# Altium schematic sheet karmanDB_power.SchDoc
size A
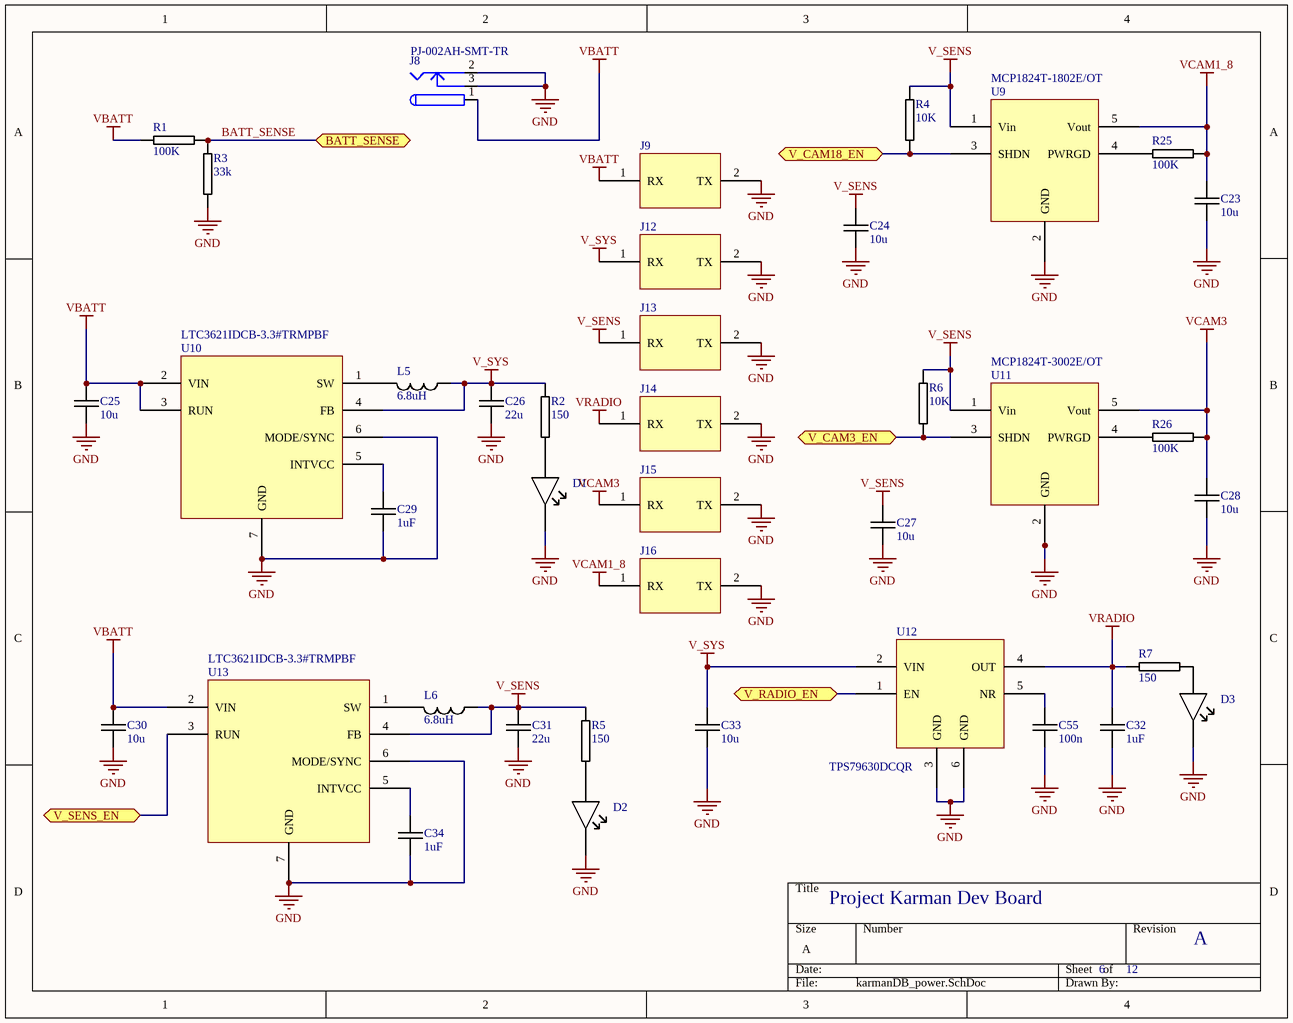
[diagram p0: karmanDB_power.SchDoc]

## Parts
C23  10u  [MURATA_GRM_0603]
C24  10u  [MURATA_GRM_0603]
C25  10u  [MURATA_GRM_0603]
C26  22u  [MURATA_GRM_0603]
C27  10u  [MURATA_GRM_0603]
C28  10u  [MURATA_GRM_0603]
C29  1uF  [MURATA_GRM_0402]
C30  10u  [MURATA_GRM_0603]
C31  22u  [MURATA_GRM_0603]
C32  1uF  [MURATA_GRM_0402]
C33  10u  [MURATA_GRM_0603]
C34  1uF  [MURATA_GRM_0402]
C55  100n  [MURATA_GRM_0603]
D1  LED_LITEON_LTST-C150CKT  [LITEON_LTST-C150]  (value not drawn)
D2  LED_LITEON_LTST-C150CKT  [LITEON_LTST-C150]  (value not drawn)
D3  LED_LITEON_LTST-C150CKT  [LITEON_LTST-C150]  (value not drawn)
J8  PJ-002AH-SMT-TR  [PJ-002AH-SMT]
J9  961102-6404-AR  [3M_961102-6X04]  (value not drawn)
J12  961102-6404-AR  [3M_961102-6X04]  (value not drawn)
J13  961102-6404-AR  [3M_961102-6X04]  (value not drawn)
J14  961102-6404-AR  [3M_961102-6X04]  (value not drawn)
J15  961102-6404-AR  [3M_961102-6X04]  (value not drawn)
J16  961102-6404-AR  [3M_961102-6X04]  (value not drawn)
L5  6.8uH  [TDK_RLF7030]
L6  6.8uH  [TDK_RLF7030]
R1  100K  [PANASONIC_ERJ3R]
R2  150  [PANASONIC_ERJ3R]
R3  33k  [PANASONIC_ERJ2R_SERIES]
R4  10K  [PANASONIC_ERJ3R]
R5  150  [PANASONIC_ERJ3R]
R6  10K  [PANASONIC_ERJ3R]
R7  150  [PANASONIC_ERJ3R]
R25  100K  [PANASONIC_ERJ3R]
R26  100K  [PANASONIC_ERJ3R]
U9  MCP1824T-1802E/OT  [26-27 MCP1824T(-3002E/OT)(-1802E/OT)]
U10  LTC3621IDCB-3.3#TRMPBF  [29 LTC3621IDCB-3.3]
U11  MCP1824T-3002E/OT  [26-27 MCP1824T(-3002E/OT)(-1802E/OT)]
U12  TPS79630DCQR  [TPS79630]
U13  LTC3621IDCB-3.3#TRMPBF  [29 LTC3621IDCB-3.3]

## Ports
BATT_SENSE (bidir), V_CAM3_EN (bidir), V_CAM18_EN (bidir), V_RADIO_EN (bidir), V_SENS_EN (bidir)

## Nets
GND: C23.2 C24.2 C25.2 C26.2 C27.2 C28.2 C29.2 C30.2 C31.2 C32.2 C33.2 C34.2 C55.2 D1.K D2.K D3.K J8.2 J8.3 J9.2(TX) J12.2(TX) J13.2(TX) J14.2(TX) J15.2(TX) J16.2(TX) R3.2 U9.2(GND) U10.6(MODE/SYNC) U10.7(GND) U11.2(GND) U12.3(GND) U12.6(GND) U13.6(MODE/SYNC) U13.7(GND)
V_SENS: C24.1 C27.1 C31.1 J13.1(RX) L6.1 R4.1 R5.1 R6.1 U9.1(Vin) U11.1(Vin) U13.4(FB)
V_SYS: C26.1 C33.1 J12.1(RX) L5.1 R2.2 U10.4(FB) U12.2(VIN)
VBATT: C25.1 C30.1 J8.1 J9.1(RX) R1.1 U10.2(VIN) U10.3(RUN) U13.2(VIN)
VCAM1_8: C23.1 J16.1(RX) R25.2 U9.5(Vout)
VCAM3: C28.1 J15.1(RX) R26.2 U11.5(Vout)
VRADIO: C32.1 J14.1(RX) R7.1 U12.4(OUT)
BATT_SENSE: R1.2 R3.1 ; port BATT_SENSE
V_CAM3_EN: R6.2 U11.3(SHDN) ; port V_CAM3_EN
V_CAM18_EN: R4.2 U9.3(SHDN) ; port V_CAM18_EN
V_RADIO_EN: U12.1(EN) ; port V_RADIO_EN
V_SENS_EN: U13.3(RUN) ; port V_SENS_EN
NetC29_1: C29.1 U10.5(INTVCC)
NetC34_1: C34.1 U13.5(INTVCC)
NetC55_1: C55.1 U12.5(NR)
NetD1_A: D1.A R2.1
NetD2_A: D2.A R5.2
NetD3_A: D3.A R7.2
NetL5_2: L5.2 U10.1(SW)
NetL6_2: L6.2 U13.1(SW)
NetR25_1: R25.1 U9.4(PWRGD)
NetR26_1: R26.1 U11.4(PWRGD)

## Notes on the sheet
- Project Karman Dev Board
- 6
- 12
- A

## Library data of the parts
C23-C25 C27 C28 C30 C33 = CAP_MURATA_GRM188R60J106: CAP CER 10UF 6.3V 20% X5R 0603; Manufacturer: Murata Electronics North America; Manufacturer Part Number: GRM188R60J106ME47J; Capacitance: 10µF; Supplier 1: Digi-Key; Supplier Part Number 1: 490-6405-1-ND; RoHS: RoHS Compliant; Category: Capacitors; Stock 1: 159118; Pricing: 1=0.19, 10=0.128, 50=0.0776, 100=0.0651, 250=0.05272, 500=0.0465, 1000=0.03953, 5000=0.03333 (USD); Packaging: Cut Tape (CT); Tolerance: ±20%; Voltage - Rated: 6.3V; Temperature Coefficient: X5R; Mounting Type: Surface Mount, MLCC; Operating Temperature: -55°C ~ 85°C; Applications: General Purpose; Ratings: -; Package / Case: 0603 (1608 Metric); Size / Dimension: 0.063" L x 0.031" W (1.60mm x 0.80mm); Height - Seated (Max): -; Thickness (Max): 0.035" (0.90mm); Lead Spacing: -; Features: -; Lead Style: -; ComponentLink1URL: http://www.murata.com/~/media/webrenewal/support/library/catalog/products/capacitor/mlcc/c02e.ashx; ComponentLink1Description: http://www.murata.com/~/media/webrenewal/support/library/catalog/products/capacitor/mlcc/c02e.ashx
C26 C31 = CAP_MURATA_GRM188R61A226ME15D: CAP CER 22UF 10V 20% X5R 0603; Manufacturer: Murata Electronics North America; Capacitance: 22µF; Supplier 1: Digi-Key; Supplier Part Number 1: 490-10476-1-ND; Manufacturer Part Number: GRM188R61A226ME15D; RoHS: RoHS Compliant; Category: Capacitors; Stock 1: 2895; Pricing: 1=0.3, 10=0.249, 25=0.1712, 50=0.14, 100=0.1244, 250=0.09332, 500=0.08242, 1000=0.07309 (USD); Packaging: Cut Tape (CT); Tolerance: ±20%; Voltage - Rated: 10V; Temperature Coefficient: X5R; Mounting Type: Surface Mount, MLCC; Operating Temperature: -55°C ~ 85°C; Applications: General Purpose; Ratings: -; Package / Case: 0603 (1608 Metric); Size / Dimension: 0.063" L x 0.031" W (1.60mm x 0.80mm); Height - Seated (Max): -; Thickness (Max): 0.039" (1.00mm); Lead Spacing: -; Features: -; Lead Style: -; ComponentLink1URL: http://www.murata.com/~/media/webrenewal/support/library/catalog/products/capacitor/mlcc/c02e.ashx; ComponentLink1Description: http://www.murata.com/~/media/webrenewal/support/library/catalog/products/capacitor/mlcc/c02e.ashx
C29 C32 C34 = CAP_MURATA_GRM155R61A105KE15D: CAP CER 1uF 10volts X5R 10% 0402; Manufacturer: Murata Electronics; Type: General Purpose MLCC; Voltage Rating DC: 10 V; Supplier 1: Mouser; Manufacturer Part Number: GRM155R61A105KE15D; RoHS: RoHS Compliant; Category: Multilayer Ceramic Capacitors MLCC - SMD/SMT; Stock 1: 726006; Pricing 1: 1=0.528, 10=0.066, 100=0.038, 1000=0.030, 2500=0.026, 10000=0.021, 20000=0.019, 50000=0.016, 100000=0.014 (AUD); Capacitance: 1 uF; Height: 0.5 mm; Length: 1 mm; Package / Case: 0402 (1005 metric); Packaging: Reel; Product: General Type MLCCs; Series: GRM; Termination Style: SMD/SMT; Tolerance: 10 %; Width: 0.5 mm; Brand: Murata Electronics; Case Code - in: 0402; Case Code - mm: 1005; Dielectric: X5R; Maximum Operating Temperature: + 85 C; Minimum Operating Temperature: - 55 C; Product Category: High Capacitance SMD Ceramic Chip Capacitors; Standard Pack Qty: 10000; RoHS - Mouser: Y; Minimum Order Quantity: 1; Reeling: True; ComponentLink1URL: http://www.mouser.com/ds/2/281/c02e-2905.pdf; ComponentLink1Description: http://www.mouser.com/ds/2/281/c02e-2905.pdf; Supplier Part Number 1: 81-GRM155R61A105KE15
C55 = CAP_MURATA_GRM188R70J104KA01D: CAP CER 0.1UF 6.3V 10% X7R 0603; Manufacturer: Murata Electronics North America; Capacitance: 0.1µF; Supplier 1: Digi-Key; Supplier Part Number 1: 490-9730-1-ND; Manufacturer Part Number: GRM188R70J104KA01D; RoHS: RoHS Compliant; Category: Capacitors; Stock 1: 25826; Pricing: 1=0.1, 10=0.061, 50=0.0332, 100=0.0281, 250=0.02296, 500=0.01964, 1000=0.0153 (USD); Packaging: Cut Tape (CT); Tolerance: ±10%; Voltage - Rated: 6.3V; Temperature Coefficient: X7R; Mounting Type: Surface Mount, MLCC; Operating Temperature: -55°C ~ 125°C; Applications: General Purpose; Ratings: -; Package / Case: 0603 (1608 Metric); Size / Dimension: 0.063" L x 0.031" W (1.60mm x 0.80mm); Height - Seated (Max): -; Thickness (Max): 0.035" (0.90mm); Lead Spacing: -; Features: -; Lead Style: -; ComponentLink1URL: http://www.murata.com/~/media/webrenewal/support/library/catalog/products/capacitor/mlcc/c02e.ashx; ComponentLink1Description: http://www.murata.com/~/media/webrenewal/support/library/catalog/products/capacitor/mlcc/c02e.ashx
D1-D3 = LED_LITEON_LTST-C150CKT: LED RED CLEAR 1206 SMD; Manufacturer: Lite-On Inc; Wavelength - Dominant: 638nm; Wavelength - Peak: 660nm; Millicandela Rating: 10mcd; Voltage - Forward (Vf) (Typ): 1.8V; Current - Test: 10mA; Viewing Angle: 130°; Lens Color: Colorless; Lens Style/Size: Rectangle with Flat Top, 2.06mm x 1.60mm; Supplier 1: Digi-Key; Supplier Part Number 1: 160-1167-1-ND; Manufacturer Part Number: LTST-C150CKT; RoHS: RoHS Compliant; Category: Optoelectronics; Stock 1: 90600; Pricing: 1=0.4, 10=0.297, 100=0.1574, 250=0.11136, 500=0.09504, 1000=0.07425 (USD); Packaging: Cut Tape (CT); Color: Red; Lens Transparency: Clear; Package / Case: 1206 (3216 Metric); Supplier Device Package: 1206; Size / Dimension: 3.20mm L x 1.60mm W; Height (Max): 1.10mm; Mounting Type: Surface Mount; ComponentLink1URL: http://optoelectronics.liteon.com/upload/download/DS-22-98-0002/S_110_LTST-C150CKT.pdf; ComponentLink1Description: http://optoelectronics.liteon.com/upload/download/DS-22-98-0002/S_110_LTST-C150CKT.pdf
J8 = PJ-002AH-SMT-TR: CONN POWER JACK 2.1X5.5MM HI CUR; Manufacturer: CUI Inc.; Gender: Male; Plug/Mating Plug Diameter: 2.1mm ID, 5.5mm OD; Number of Positions/Contacts: 2 Conductors, 3 Contacts; Internal Switch(s): Single Switch, Normally Closed; Shielding: Unshielded; Voltage - Rated: 24VDC; Current Rating: 5A; Supplier 1: Digi-Key; Manufacturer Part Number: PJ-002AH-SMT-TR; RoHS: RoHS Compliant; Category: Connectors, Interconnects; Stock 1: 15720; Pricing 1: 1=1.89, 10=1.469, 100=1.121 (USD); Connector Type: Jack; Mounting Type: Surface Mount; Termination: Solder; Features: -; Color: Black; Contact Material: Copper Alloy; Contact Material - Plating: Nickel; Housing Color: Black; Housing Material: Thermoplastic; Operating Temperature: -25°C ~ 85°C; ComponentLink1URL: http://www.cui.com/product/resource/digikeypdf/pj-002ah-smt.pdf; ComponentLink1Description: http://www.cui.com/product/resource/digikeypdf/pj-002ah-smt.pdf; Supplier Part Number 1: CP-002AHPJCT-ND
J9 J12-J16 = 961102-6404-AR: CONN HEADER VERT SGL 2POS GOLD; Manufacturer: 3M; Connector Type: Header, Unshrouded; Number of Positions: 2; Number of Positions Loaded: All; Pitch: 0.100" (2.54mm); Supplier 1: Digi-Key; Manufacturer Part Number: 961102-6404-AR; RoHS: RoHS Compliant; Category: Connectors, Interconnects; Stock 1: 60000; Pricing 1: 1=0.16, 10=0.15, 25=0.128, 50=0.112, 100=0.104, 250=0.092, 500=0.088, 1000=0.072, 2500=0.066 (USD); Packaging: Bulk; Contact Type: Male Pin; Number of Rows: 1; Row Spacing: -; Contact Mating Length: 0.217" (5.50mm); Mounting Type: Through Hole; Termination: Solder; Fastening Type: -; Features: -; Contact Finish: Gold; Contact Finish Thickness: Flash; Color: Black; ComponentLink1URL: http://multimedia.3m.com/mws/mediawebserver?66666UuZjcFSLXTtNxTElX&VEVuQEcuZgVs6EVs6E666666--; ComponentLink1Description: http://multimedia.3m.com/mws/mediawebserver?66666UuZjcFSLXTtNxTElX&VEVuQEcuZgVs6EVs6E666666--; Supplier Part Number 1: 3M9447-ND
L5 L6 = TDK_IND_RLF7030T-6R8M2R8: FIXED IND 6.8UH 2.8A 37.3 MOHM; Manufacturer: TDK Corporation; Type: Wirewound; Material - Core: Ferrite; Inductance: 6.8µH; Tolerance: ±20%; Current - Saturation: 3A; Shielding: Shielded; DC Resistance (DCR): 44.76 mOhm Max; Frequency - Test: 100kHz; Supplier 1: Digi-Key; Manufacturer Part Number: RLF7030T-6R8M2R8; RoHS: RoHS Compliant; Category: Inductors, Coils, Chokes; Stock 1: 8675; Pricing 1: 1=2.31, 10=2.153, 50=1.7528, 100=1.599, 500=1.353 (USD); Packaging: Cut Tape (CT); Current Rating: 2.8A; Q @ Freq: -; Frequency - Self Resonant: -; Operating Temperature: -40°C ~ 125°C; Mounting Type: Surface Mount; Package / Case: Nonstandard; Size / Dimension: 0.287" L x 0.268" W (7.30mm x 6.80mm); Height - Seated (Max): 0.126" (3.20mm); Supplier Device Package: -; ComponentLink1URL: http://product.tdk.com/inductor/ind/en/documents/inductor_commercial_power_rlf_en.pdf; ComponentLink1Description: http://product.tdk.com/inductor/ind/en/documents/inductor_commercial_power_rlf_en.pdf; Supplier Part Number 1: 445-2965-1-ND
R1 R25 R26 = RES_PANASONIC_ERJ-3GEYJ104V: RES SMD 100K OHM 5% 1/10W 0603; Manufacturer: Panasonic Electronic Components; Power (Watts): 0.1W, 1/10W; Temperature Coefficient: ±200ppm/°C; Supplier 1: Digi-Key; Supplier Part Number 1: P100KGCT-ND; Manufacturer Part Number: ERJ-3GEYJ104V; RoHS: RoHS Compliant; Category: Resistors; Stock 1: 1746081; Pricing: 1=0.1, 50=0.0096, 100=0.0071, 250=0.00544, 500=0.00436, 1000=0.00321 (USD); Packaging: Cut Tape (CT); Resistance (Ohms): 100k; Tolerance: ±5%; Composition: Thick Film; Features: Automotive AEC-Q200; Operating Temperature: -55°C ~ 155°C; Package / Case: 0603 (1608 Metric); Supplier Device Package: 0603; Size / Dimension: 0.063" L x 0.031" W (1.60mm x 0.80mm); Height: 0.022" (0.55mm); Number of Terminations: 2; ComponentLink1URL: http://industrial.panasonic.com/www-cgi/jvcr13pz.cgi?E+PZ+3+AOA0001+ERJ3GEYJ104V+7+WW; ComponentLink1Description: http://industrial.panasonic.com/www-cgi/jvcr13pz.cgi?E+PZ+3+AOA0001+ERJ3GEYJ104V+7+WW
R2 R5 R7 = RES_PANASONIC_ERJ-3GEYJ151V: RES SMD 150 OHM 5% 1/10W 0603; Manufacturer: Panasonic Electronic Components; Power (Watts): 0.1W, 1/10W; Temperature Coefficient: ±200ppm/°C; Supplier 1: Digi-Key; Supplier Part Number 1: P150GCT-ND; Manufacturer Part Number: ERJ-3GEYJ151V; RoHS: RoHS Compliant; Category: Resistors; Stock 1: 236723; Pricing: 1=0.1, 50=0.0096, 100=0.0071, 250=0.00544, 500=0.00436, 1000=0.00321 (USD); Packaging: Cut Tape (CT); Resistance (Ohms): 150; Tolerance: ±5%; Composition: Thick Film; Features: Automotive AEC-Q200; Operating Temperature: -55°C ~ 155°C; Package / Case: 0603 (1608 Metric); Supplier Device Package: 0603; Size / Dimension: 0.063" L x 0.031" W (1.60mm x 0.80mm); Height: 0.022" (0.55mm); Number of Terminations: 2; ComponentLink1URL: http://industrial.panasonic.com/www-cgi/jvcr13pz.cgi?E+PZ+3+AOA0001+ERJ3GEYJ151V+7+WW; ComponentLink1Description: http://industrial.panasonic.com/www-cgi/jvcr13pz.cgi?E+PZ+3+AOA0001+ERJ3GEYJ151V+7+WW
R3 = RES_PANASONIC_ERJ-2GEJ333X: RES SMD 33K OHM 5% 1/10W 0402; Manufacturer: Panasonic Electronic Components; Power (Watts): 0.1W, 1/10W; Temperature Coefficient: ±200ppm/°C; Supplier 1: Digi-Key; Manufacturer Part Number: ERJ-2GEJ333X; RoHS: RoHS Compliant; Category: Resistors; Stock 1: 860000; Pricing 1: 10000=0.00198, 30000=0.00174, 50000=0.0016, 100000=0.00156 (USD); Packaging: Tape & Reel (TR); Resistance (Ohms): 33k; Tolerance: ±5%; Composition: Thick Film; Features: Automotive AEC-Q200; Operating Temperature: -55°C ~ 155°C; Package / Case: 0402 (1005 Metric); Supplier Device Package: 0402; Size / Dimension: 0.039" L x 0.020" W (1.00mm x 0.50mm); Height: 0.016" (0.40mm); Number of Terminations: 2; ComponentLink1URL: http://industrial.panasonic.com/www-cgi/jvcr13pz.cgi?E+PZ+3+AOA0001+ERJ2GEJ333X+7+WW; ComponentLink1Description: http://industrial.panasonic.com/www-cgi/jvcr13pz.cgi?E+PZ+3+AOA0001+ERJ2GEJ333X+7+WW; Supplier Part Number 1: P33KJTR-ND
R4 R6 = RES_PANASONIC_ERJ-3GEYJ103V: RES SMD 10K OHM 5% 1/10W 0603; Manufacturer: Panasonic Electronic Components; Power (Watts): 0.1W, 1/10W; Temperature Coefficient: ±200ppm/°C; Supplier 1: Digi-Key; Supplier Part Number 1: P10KGCT-ND; Manufacturer Part Number: ERJ-3GEYJ103V; RoHS: RoHS Compliant; Category: Resistors; Stock 1: 4229597; Pricing: 1=0.1, 50=0.0096, 100=0.0071, 250=0.00544, 500=0.00436, 1000=0.00321 (USD); Packaging: Cut Tape (CT); Resistance (Ohms): 10k; Tolerance: ±5%; Composition: Thick Film; Features: Automotive AEC-Q200; Operating Temperature: -55°C ~ 155°C; Package / Case: 0603 (1608 Metric); Supplier Device Package: 0603; Size / Dimension: 0.063" L x 0.031" W (1.60mm x 0.80mm); Height: 0.022" (0.55mm); Number of Terminations: 2; ComponentLink1URL: http://industrial.panasonic.com/www-cgi/jvcr13pz.cgi?E+PZ+3+AOA0001+ERJ3GEYJ103V+7+WW; ComponentLink1Description: http://industrial.panasonic.com/www-cgi/jvcr13pz.cgi?E+PZ+3+AOA0001+ERJ3GEYJ103V+7+WW
U9 = MCP1824T-1802E/OT: IC REG LDO 1.8V 0.3A SOT23-5; Manufacturer: Microchip Technology; Regulator Topology: Positive Fixed; Current - Output: 300mA; Voltage - Dropout (Typical): 0.2V @ 300mA; Number of Regulators: 1; Voltage - Input: 2.1 V ~ 6 V; Supplier 1: Digi-Key; Manufacturer Part Number: MCP1824T-1802E/OT; RoHS: RoHS Compliant; Category: Integrated Circuits (ICs); Stock 1: 10644; Pricing 1: 1=0.5, 10=0.42, 25=0.35, 100=0.32 (USD); Packaging: Cut Tape (CT); Voltage - Output: 1.8V; Current - Limit (Min): -; Operating Temperature: -40°C ~ 125°C; Mounting Type: Surface Mount; Package / Case: SC-74A, SOT-753; Supplier Device Package: SOT-23-5; ComponentLink1URL: http://www.microchip.com/mymicrochip/filehandler.aspx?ddocname=en533257; ComponentLink1Description: http://www.microchip.com/mymicrochip/filehandler.aspx?ddocname=en533257; Supplier Part Number 1: MCP1824T-1802E/OTCT-ND
U10 U13 = LTC3621IDCB-3.3#TRMPBF: IC REG BUCK 3.3V 1A SYNC 6DFN; Manufacturer: Linear Technology; Function: Step-Down; Output Configuration: Positive; Output Type: Fixed; Number of Outputs: 1; Voltage - Input (Min): 2.7V; Voltage - Input (Max): 17V; Frequency - Switching: 1MHz; Synchronous Rectifier: Yes; Supplier 1: Digi-Key; Manufacturer Part Number: LTC3621IDCB-3.3#TRMPBF; RoHS: RoHS Compliant; Category: Integrated Circuits (ICs); Stock 1: 490; Pricing 1: 1=6.84, 25=6.1052, 100=5.4948 (USD); Packaging: Cut Tape (CT); Topology: Buck; Voltage - Output (Min/Fixed): 3.3V; Voltage - Output (Max): -; Current - Output: 1A; Operating Temperature: -40°C ~ 125°C (TJ); Mounting Type: Surface Mount; Package / Case: 6-WFDFN Exposed Pad; Supplier Device Package: 6-DFN (2x3); ComponentLink1URL: http://www.linear.com/docs/42954; ComponentLink1Description: http://www.linear.com/docs/42954; Supplier Part Number 1: LTC3621IDCB-3.3#TRMPBFCT-ND
U11 = MCP1824T-3002E/OT: IC REG LDO 3V 0.3A SOT23-5; Manufacturer: Microchip Technology; Regulator Topology: Positive Fixed; Current - Output: 300mA; Voltage - Dropout (Typical): 0.2V @ 300mA; Number of Regulators: 1; Voltage - Input: Up to 6V; Supplier 1: Digi-Key; Manufacturer Part Number: MCP1824T-3002E/OT; RoHS: RoHS Compliant; Category: Integrated Circuits (ICs); Stock 1: 1155; Pricing 1: 1=0.5, 10=0.42, 25=0.35, 100=0.32 (USD); Packaging: Cut Tape (CT); Voltage - Output: 3V; Current - Limit (Min): -; Operating Temperature: -40°C ~ 125°C; Mounting Type: Surface Mount; Package / Case: SC-74A, SOT-753; Supplier Device Package: SOT-23-5; ComponentLink1URL: http://www.microchip.com/mymicrochip/filehandler.aspx?ddocname=en533257; ComponentLink1Description: http://www.microchip.com/mymicrochip/filehandler.aspx?ddocname=en533257; Supplier Part Number 1: MCP1824T-3002E/OTCT-ND
U12 = TPS79630DCQR: IC REG LDO 3V 1A SOT223-6; Manufacturer: Texas Instruments; Regulator Topology: Positive Fixed; Voltage - Dropout (Typical): 0.25V @ 1A; Number of Regulators: 1; Voltage - Input: Up to 5.5V; Current - Limit (Min): 2.4A; Supplier 1: Digi-Key; Manufacturer Part Number: TPS79630DCQR; RoHS: RoHS Compliant; Category: Integrated Circuits (ICs); Stock 1: 4641; Pricing 1: 1=3.13, 10=2.825, 25=2.5308, 100=2.2759, 250=2.02088, 500=1.7658, 750=1.59903, 1000=1.22625 (USD); Packaging: Cut Tape (CT); Voltage - Output: 3V; Current - Output: 1A; Operating Temperature: -40°C ~ 125°C; Mounting Type: Surface Mount; Package / Case: SOT-223-6; Supplier Device Package: SOT-223-6; ComponentLink1URL: http://www.ti.com/lit/ds/symlink/tps796.pdf; ComponentLink1Description: http://www.ti.com/lit/ds/symlink/tps796.pdf; Supplier Part Number 1: 296-13765-1-ND